# Altium schematic sheet clock.SchDoc
size A4
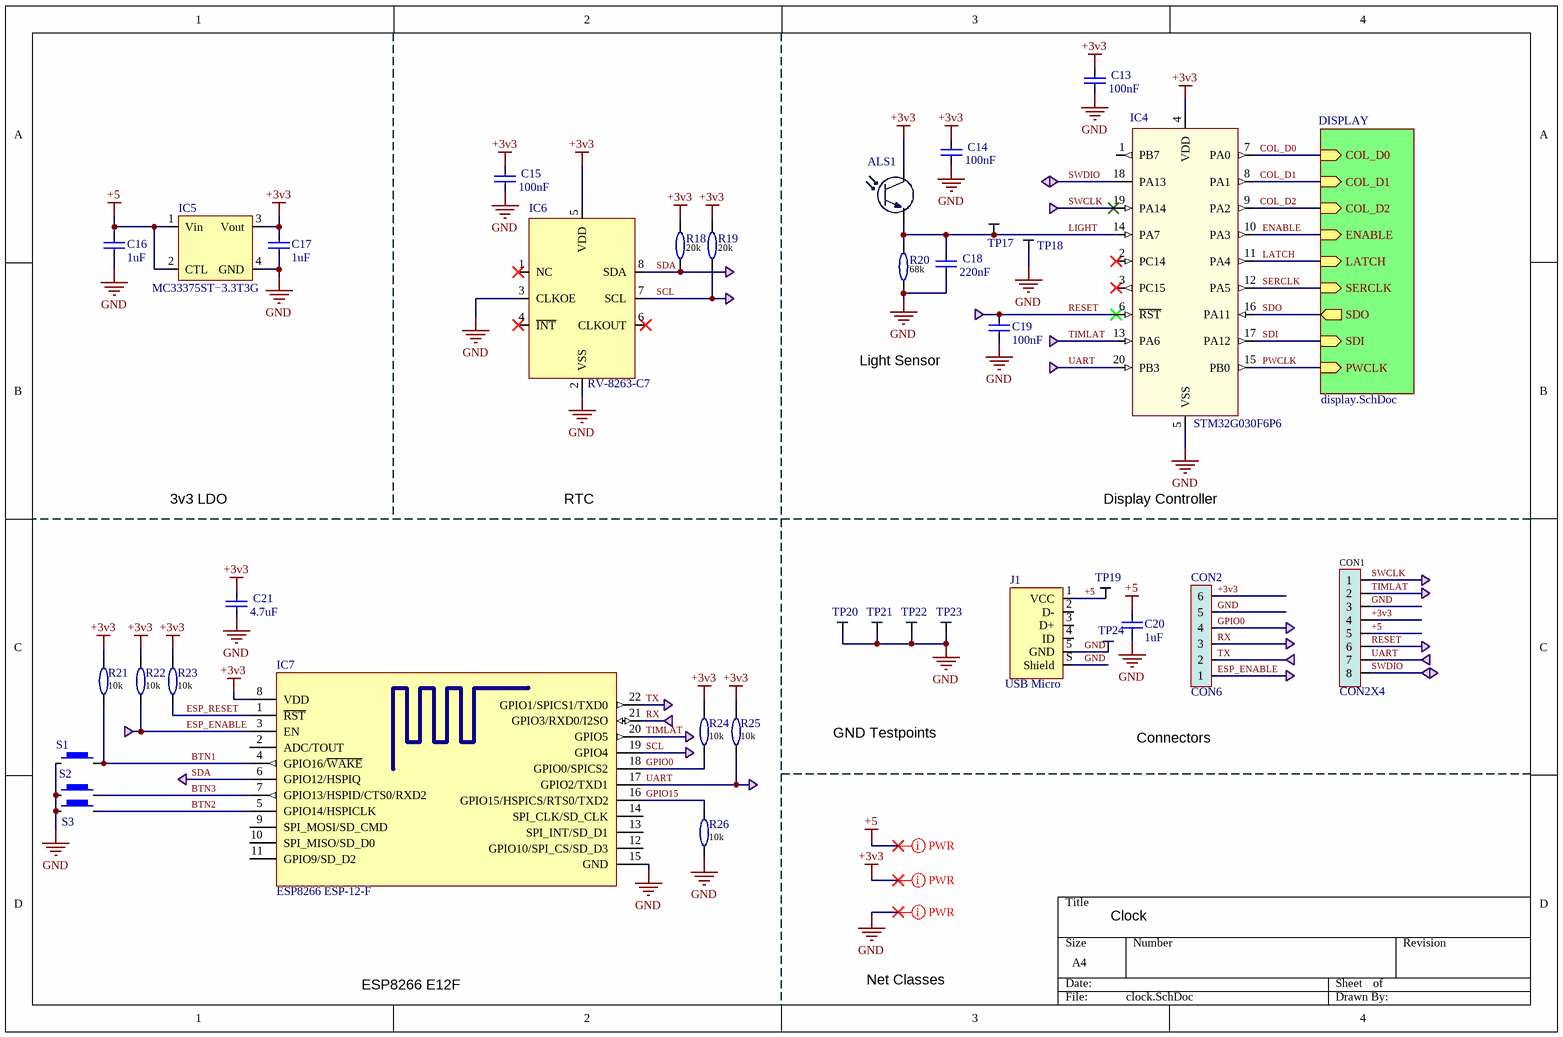
[diagram p0: clock.SchDoc]

## Parts
ALS1  PHOTOTRANSISTOR  [ALS-PT19-315C]  (value not drawn)
C13  value 100nF  [CAPC_0603_1608X08L]  (hidden comment: Cap)
C14  value 100nF  [CAPC_0603_1608X08L]  (hidden comment: Cap)
C15  value 100nF  [CAPC_0603_1608X08L]  (hidden comment: Cap)
C16  value 1uF  [CAPC_0603_1608X08L]  (hidden comment: Cap)
C17  value 1uF  [CAPC_0603_1608X08L]  (hidden comment: Cap)
C18  value 220nF  [CAPC_0603_1608X08L]  (hidden comment: Cap)
C19  value 100nF  [CAPC_0603_1608X08L]  (hidden comment: Cap)
C20  value 1uF  [CAPC_1206_3216X16L]  (hidden comment: Cap)
C21  value 4.7uF  [CAPC_1206_3216X16L]  (hidden comment: Cap)
CON1  CON2X4  [CON2X4]  (no BOM)
CON2  CON6  [CON2X3]  (no BOM)
IC4  STM32G030F6P6  [TSOP65P630X120-20L]
IC5  MC33375ST−3.3T3G  [SOT230P700X180-4N]
IC6  RV-8263-C7  [RV-8263-C7]
IC7  ESP8266 ESP-12-F  [ESP8266 ESP-12-E]
J1  USB Micro  [USB 1051330011]
R18  value 20k  [RESC1608X03L]  (hidden comment: RES0603)
R19  value 20k  [RESC1608X03L]  (hidden comment: RES0603)
R20  value 68k  [RESC1608X03L]  (hidden comment: RES0603)
R21  value 10k  [RESC1608X03L]  (hidden comment: RES0603)
R22  value 10k  [RESC1608X03L]  (hidden comment: RES0603)
R23  value 10k  [RESC1608X03L]  (hidden comment: RES0603)
R24  value 10k  [RESC1608X03L]  (hidden comment: RES0603)
R25  value 10k  [RESC1608X03L]  (hidden comment: RES0603)
R26  value 10k  [RESC1608X03L]  (hidden comment: RES0603)
S1  4-1437565-1  [FSM-SWITCH]  (value not drawn)
S2  4-1437565-1  [FSM-SWITCH]  (value not drawn)
S3  4-1437565-1  [FSM-SWITCH]  (value not drawn)
TP17  TESTPOINT  [TESTPOINT_BIG]  (value not drawn)  (no BOM)
TP18  TESTPOINT  [TESTPOINT_GND]  (value not drawn)  (no BOM)
TP19  TESTPOINT  [TESTPOINT_BIG]  (value not drawn)  (no BOM)
TP20  TESTPOINT  [TESTPOINT_GND]  (value not drawn)  (no BOM)
TP21  TESTPOINT  [TESTPOINT_GND]  (value not drawn)  (no BOM)
TP22  TESTPOINT  [TESTPOINT_GND]  (value not drawn)  (no BOM)
TP23  TESTPOINT  [TESTPOINT_GND]  (value not drawn)  (no BOM)
TP24  TESTPOINT  [TESTPOINT_GND]  (value not drawn)  (no BOM)

## Sub-sheets
DISPLAY = display.SchDoc: SERCLK (in), SDI (in), LATCH (in), COL_D0 (in), COL_D2 (in), COL_D1 (in), ENABLE (in), PWCLK (in), SDO (out)

## Nets
+3v3: ALS1.1(COLLECTOR) C13.2 C14.2 C15.2 C17.2 C21.2 CON1.4 CON2.6 IC4.4(VDD) IC5.3(Vout) IC6.5(VDD) IC7.8(VDD) R18.2 R19.2 R21.1 R22.1 R23.1 R24.1 R25.1
+5: C16.2 C20.2 CON1.5 IC5.1(Vin) IC5.2(CTL) J1.1(VCC) TP19.1(EMITTER)
GND: C13.1 C14.1 C15.1 C16.1 C17.1 C18.1 C19.1 C20.1 C21.1 CON1.3 CON2.5 IC4.5(VSS) IC5.4(GND) IC6.2(VSS) IC6.3(CLKOE) IC7.15(GND) J1.5(GND) J1.S(Shield) R20.1 R26.2 S1.1 S2.1 S3.1 TP18.1(EMITTER) TP20.1(EMITTER) TP21.1(EMITTER) TP22.1(EMITTER) TP23.1(EMITTER) TP24.1(EMITTER)
BTN1: IC7.4(GPIO16/~{WAKE}) R21.2 S1.2
BTN2: IC7.5(GPIO14/HSPICLK) S3.2
BTN3: IC7.7(GPIO13/HSPID/CTS0/RXD2) S2.2
COL_D0: IC4.7(PA0) ; sheet DISPLAY/COL_D0
COL_D1: IC4.8(PA1) ; sheet DISPLAY/COL_D1
COL_D2: IC4.9(PA2) ; sheet DISPLAY/COL_D2
ENABLE: IC4.10(PA3) ; sheet DISPLAY/ENABLE
ESP_ENABLE: CON2.1 IC7.3(EN) R22.2
ESP_RESET: IC7.1(~{RST}) R23.2
GPIO0: CON2.4 IC7.18(GPIO0/SPICS2) R24.2
GPIO15: IC7.16(GPIO15/HSPICS/RTS0/TXD2) R26.1
LATCH: IC4.11(PA4) ; sheet DISPLAY/LATCH
LIGHT: ALS1.2(EMITTER) C18.2 IC4.14(PA7) R20.2 TP17.1(EMITTER)
PWCLK: IC4.15(PB0) ; sheet DISPLAY/PWCLK
RESET: C19.2 CON1.6 IC4.6(~{RST})
RX: CON2.3 IC7.21(GPIO3/RXD0/I2SO)
SCL: IC6.7(SCL) IC7.19(GPIO4) R19.1
SDA: IC6.8(SDA) IC7.6(GPIO12/HSPIQ) R18.1
SDI: IC4.17(PA12) ; sheet DISPLAY/SDI
SDO: IC4.16(PA11) ; sheet DISPLAY/SDO
SERCLK: IC4.12(PA5) ; sheet DISPLAY/SERCLK
SWCLK: CON1.1 IC4.19(PA14)
SWDIO: CON1.8 IC4.18(PA13)
TIMLAT: CON1.2 IC4.13(PA6) IC7.20(GPIO5)
TX: CON2.2 IC7.22(GPIO1/SPICS1/TXD0)
UART: CON1.7 IC4.20(PB3) IC7.17(GPIO2/TXD1) R25.2

Not connected (* = marked no-connect by the designer): IC4 1(PB7) 2(PC14)* 3(PC15)*; IC6 1(NC)* 4(~{INT})* 6(CLKOUT)*; IC7 2(ADC/TOUT) 9(SPI_MOSI/SD_CMD) 10(SPI_MISO/SD_D0) 11(GPIO9/SD_D2) 12(GPIO10/SPI_CS/SD_D3) 13(SPI_INT/SD_D1) 14(SPI_CLK/SD_CLK); J1 2(D-) 3(D+) 4(ID)

## Layout directives
net class PWR: +3v3, +5, GND

## Notes on the sheet
- Light Sensor
- 3v3 LDO
- RTC
- Display Controller
- GND Testpoints
- Connectors
- Clock
- ESP8266 E12F
- Net Classes

## Library data of the parts
ALS1 = PHOTOTRANSISTOR: Photo transistor
C13-C21 = Cap: Capacitor; Published: 8-Jun-2000; LatestRevisionDate: 17-Jul-2002; LatestRevisionNote: Re-released for DXP Platform.; PackageReference: RAD-0.3; Publisher: Altium Limited; PackageDescription: Radial Cap, Thru-Hole; 2 Leads; 0.3 in Pin Spacing
CON1 = CON2X4: Header 4 way
CON2 = CON6: Debug header 6 way
IC4 = STM32G030F6P6: MCU 64MHz tssop20
IC5 = MC33375ST−3.3T3G: 3.3v LDO
J1 = USB 2.0 Type B Micro: USB 2.0 Type B Micro vertical SMT; ClassName: USB_CONNECTOR
R18-R26 = RES0603: Chip Resistor
S1-S3 = tactile switch: 6x6mm SMD tactile switch,SPST-NO; Manufacturer_Name: TE Connectivity; Allied_Number: R1117787; RS Part Number: 1616046; Manufacturer_Part_Number: 4-1437565-1; Datasheet Link: http://uk.rs-online.com/web/p/products/1616046